# EAGLE design stoomshield1 (EAGLE 7.2.0)
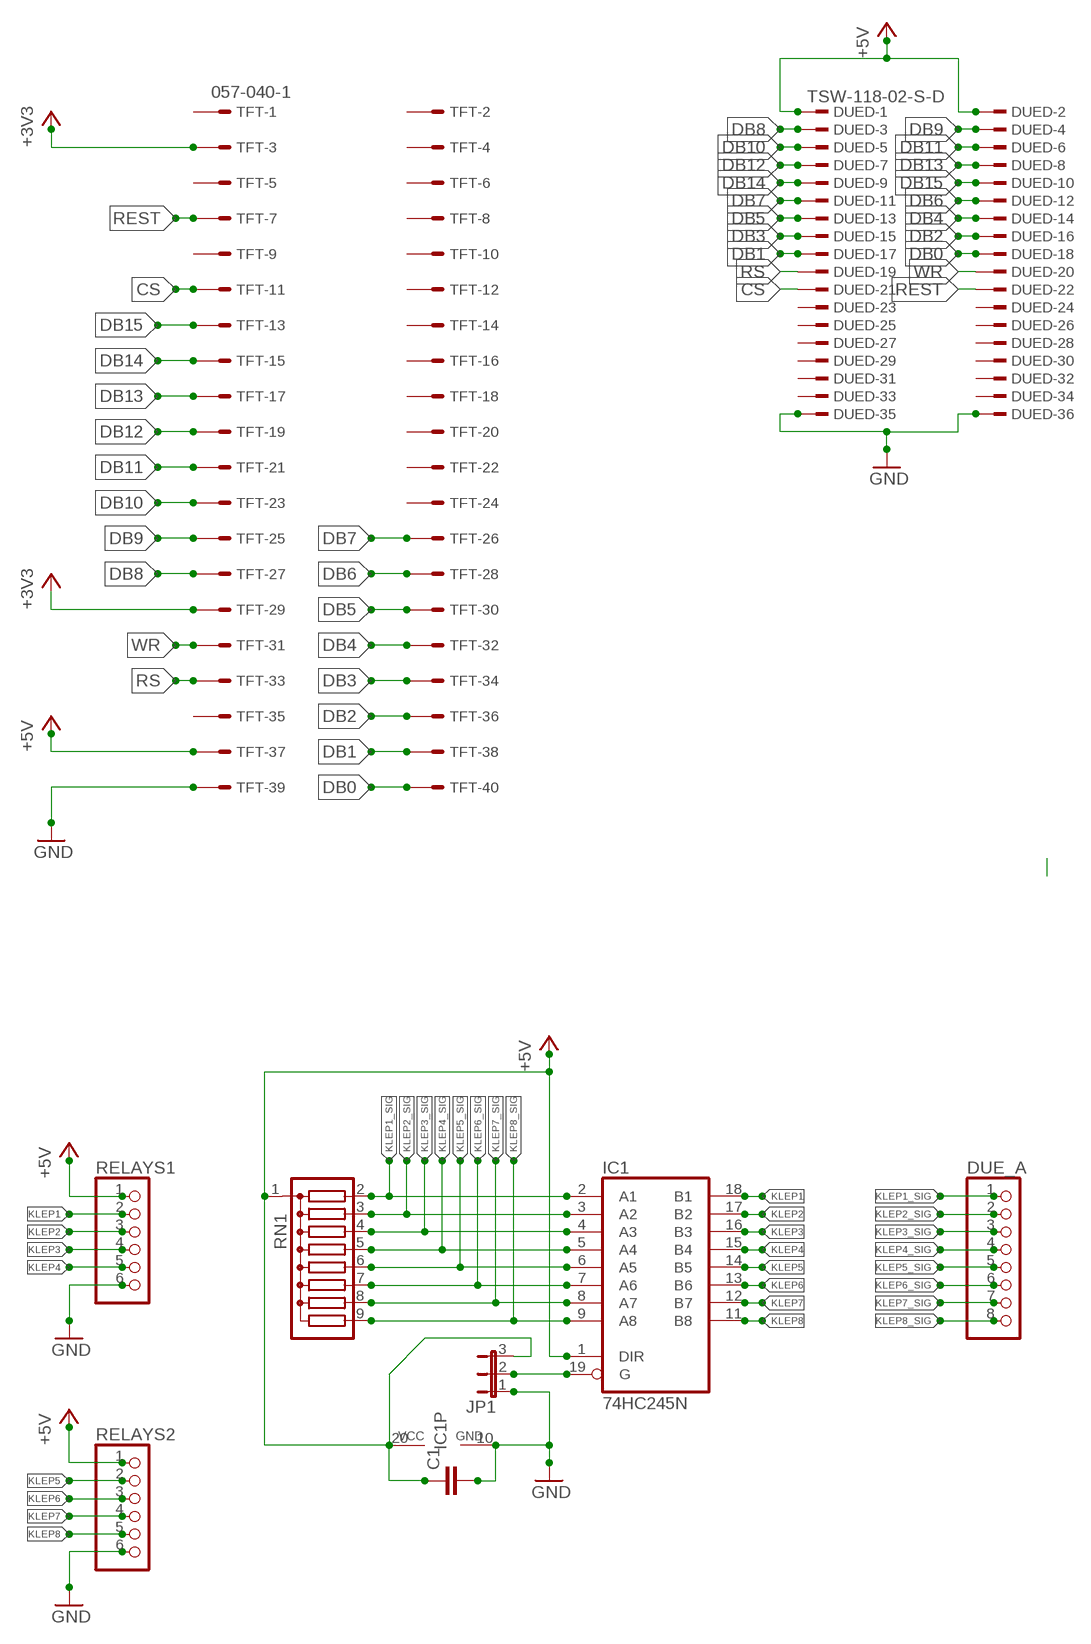
[diagram p0: schematic, sheet 1, part 1 of 2]
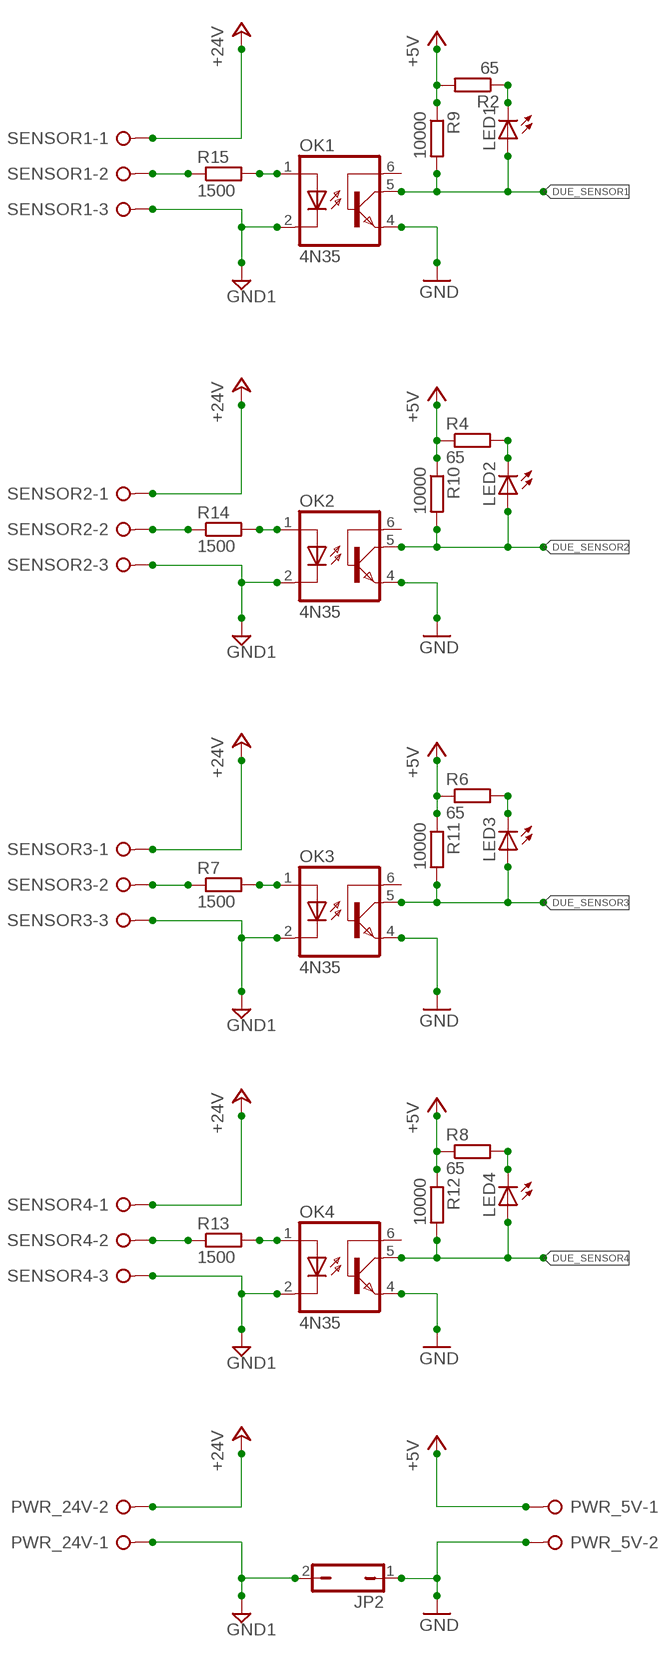
[diagram p1: schematic, sheet 1, part 2 of 2]

## Parts
C1  C-EU025-024X044  [C025-024X044]
DUE_A  PINHD-1X8  [1X08]
DUED  TSW-118-02-S-D  [TSW-118-02-S-D]
IC1  74HC245N  [DIL20]
JP1  JP2E  [JP2]
JP2  JP1Q  [JP1]
LED1  LED5MM  [LED5MM]
LED2  LED5MM  [LED5MM]
LED3  LED5MM  [LED5MM]
LED4  LED5MM  [LED5MM]
OK1  4N35  [DIL06]
OK2  4N35  [DIL06]
OK3  4N35  [DIL06]
OK4  4N35  [DIL06]
PWR_5V  W237-02P  [W237-132]
PWR_24V  W237-02P  [W237-132]
R2  65  R-EU_0204/5  [0204/5]
R4  65  R-EU_0204/5  [0204/5]
R6  65  R-EU_0204/5  [0204/5]
R7  1500  R-EU_0204/5  [0204/5]
R8  65  R-EU_0204/5  [0204/5]
R9  10000  R-EU_0204/5  [0204/5]
R10  10000  R-EU_0204/5  [0204/5]
R11  10000  R-EU_0204/5  [0204/5]
R12  10000  R-EU_0204/5  [0204/5]
R13  1500  R-EU_0204/5  [0204/5]
R14  1500  R-EU_0204/5  [0204/5]
R15  1500  R-EU_0204/5  [0204/5]
RELAYS1  PINHD-1X6  [1X06]
RELAYS2  PINHD-1X6  [1X06]
RN1  G08R  [SIL9]
SENSOR1  W237-03P  [W237-133]
SENSOR2  W237-03P  [W237-133]
SENSOR3  W237-03P  [W237-133]
SENSOR4  W237-03P  [W237-133]
TFT  057-040-1  [057-040-1]

## Nets
+3V3: TFT.3 TFT.29
+5V: C1.1 DUED.1 DUED.2 IC1.1(DIR) IC1.20(VCC) JP1.3 PWR_5V.1 R2.2 R4.1 R6.1 R8.1 R9.1 R10.1 R11.1 R12.1 RELAYS1.1 RELAYS2.1 RN1.1 TFT.37
+24V: PWR_24V.2 SENSOR1.1 SENSOR2.1 SENSOR3.1 SENSOR4.1
CS: DUED.21 TFT.11
DB0: DUED.18 TFT.40
DB1: DUED.17 TFT.38
DB2: DUED.16 TFT.36
DB3: DUED.15 TFT.34
DB4: DUED.14 TFT.32
DB5: DUED.13 TFT.30
DB6: DUED.12 TFT.28
DB7: DUED.11 TFT.26
DB8: DUED.3 TFT.27
DB9: DUED.4 TFT.25
DB10: DUED.5 TFT.23
DB11: DUED.6 TFT.21
DB12: DUED.7 TFT.19
DB13: DUED.8 TFT.17
DB14: DUED.9 TFT.15
DB15: DUED.10 TFT.13
DUE_SENSOR1: LED1.A OK1.5(COL) R9.2
DUE_SENSOR2: LED2.A OK2.5(COL) R10.2
DUE_SENSOR3: LED3.A OK3.5(COL) R11.2
DUE_SENSOR4: LED4.A OK4.5(COL) R12.2
GND: C1.2 DUED.35 DUED.36 IC1.10(GND) JP1.1 JP2.1 OK1.4(EMI) OK2.4(EMI) OK3.4(EMI) OK4.4(EMI) PWR_5V.2 RELAYS1.6 RELAYS2.6 TFT.39
GND1: JP2.2 OK1.2(C) OK2.2(C) OK3.2(C) OK4.2(C) PWR_24V.1 SENSOR1.3 SENSOR2.3 SENSOR3.3 SENSOR4.3
KLEP1: IC1.18(B1) RELAYS1.2
KLEP1_SIG: DUE_A.1 IC1.2(A1) RN1.2
KLEP2: IC1.17(B2) RELAYS1.3
KLEP2_SIG: DUE_A.2 IC1.3(A2) RN1.3
KLEP3: IC1.16(B3) RELAYS1.4
KLEP3_SIG: DUE_A.3 IC1.4(A3) RN1.4
KLEP4: IC1.15(B4) RELAYS1.5
KLEP4_SIG: DUE_A.4 IC1.5(A4) RN1.5
KLEP5: IC1.14(B5) RELAYS2.2
KLEP5_SIG: DUE_A.5 IC1.6(A5) RN1.6
KLEP6: IC1.13(B6) RELAYS2.3
KLEP6_SIG: DUE_A.6 IC1.7(A6) RN1.7
KLEP7: IC1.12(B7) RELAYS2.4
KLEP7_SIG: DUE_A.7 IC1.8(A7) RN1.8
KLEP8: IC1.11(B8) RELAYS2.5
KLEP8_SIG: DUE_A.8 IC1.9(A8) RN1.9
N$1: IC1.19(G) JP1.2
N$3: R15.1 SENSOR1.2
N$4: OK1.1(A) R15.2
N$5: LED1.K(C) R2.1
N$6: OK2.1(A) R14.2
N$7: R14.1 SENSOR2.2
N$8: LED2.K(C) R4.2
N$9: OK3.1(A) R7.2
N$10: R7.1 SENSOR3.2
N$11: LED3.K(C) R6.2
N$12: OK4.1(A) R13.2
N$13: R13.1 SENSOR4.2
N$14: LED4.K(C) R8.2
REST: DUED.22 TFT.7
RS: DUED.19 TFT.33
WR: DUED.20 TFT.31
Unconnected: DUED.23 DUED.24 DUED.25 DUED.26 DUED.27 DUED.28 DUED.29 DUED.30 DUED.31 DUED.32 DUED.33 DUED.34 OK1.6(BAS) OK2.6(BAS) OK3.6(BAS) OK4.6(BAS) TFT.1 TFT.2 TFT.4 TFT.5 TFT.6 TFT.8 TFT.9 TFT.10 TFT.12 TFT.14 TFT.16 TFT.18 TFT.20 TFT.22 TFT.24 TFT.35

## Library data of the parts
C1 = rcl:C-EU: CAPACITOR, European symbol
DUE_A = pinhead:PINHD-1X8: PIN HEADER
DUED = con-samtec:TSW-118-02-S-D: THROUGH-HOLE .025" SQ POST HEADER Source: Samtec TSW.pdf; OC_FARNELL: unknown; OC_NEWARK: unknown
IC1 = 74xx-eu:74*245: Octal BUS TRANSCEIVER, 3-state
JP1 = jumper:JP2E: JUMPER
JP2 = jumper:JP1Q: JUMPER
LED1-LED4 = led:LED: LED OSRAM: - CHIPLED LG R971, LG N971, LY N971, LG Q971, LY Q971, LO R971, LY R971 LH N974, LH R974 LS Q976, LO Q976, LY Q976 LO Q996 - Hyper CHIPLED LW Q18S LB Q993, LB Q99A, LB R99A - SideLED LS A670, LO A670, LY A670, LG A670, LP A670 LB A673, LV A673, LT A673, LW A673 LH A674 LY A675 LS A676, LA A676, LO A676, LY A676, LW A676 LS A679, LY A679, LG A679 - Hyper Micro SIDELED® LS Y876, LA Y876, LO Y876, LY Y876 LT Y87S - SmartLED LW L88C, LW L88S LB L89C, LB L89S, LG L890 LS L89K, LO L89K, LY L89K LS L896, LA L896, LO L896, LY L896 - TOPLED LS T670, LO T670, LY T670, LG T670, LP T670 LSG T670, LSP T670, LSY T670, LOP T670, LYG T670 LG T671, LOG T671, LSG T671 LB T673, LV T673, LT T673, LW T673 LH T674 LS T676, LA T676, LO T676, LY T676, LB T676, LH T676, LSB T676, LW T676 LB T67C, LV T67C, LT T67C, LS T67K, LO T67K, LY T67K, LW E67C LS E67B, LA E67B, LO E67B, LY E67B, LB E67C, LV E67C, LT E67C LW T67C LS T679, LY T679, LG T679 LS T770, LO T770, LY T770, LG T770, LP T770 LB T773, LV T773, LT T773, LW T773 LH T774 LS E675, LA E675, LY E675, LS T675 LS T776, LA T776, LO T776, LY T776, LB T776 LHGB T686 LT T68C, LB T68C - Hyper Mini TOPLED® LB M676 - Mini TOPLED Santana® LG M470 LS M47K, LO M47K, LY M47K Source: http://www.osram.convergy.de LUXEON: - LUMILED® LXK2-PW12-R00, LXK2-PW12-S00, LXK2-PW14-U00, LXK2-PW14-V00 LXK2-PM12-R00, LXK2-PM12-S00, LXK2-PM14-U00 LXK2-PE12-Q00, LXK2-PE12-R00, LXK2-PE12-S00, LXK2-PE14-T00, LXK2-PE14-U00 LXK2-PB12-K00, LXK2-PB12-L00, LXK2-PB12-M00, LXK2-PB14-N00, LXK2-PB14-P00, LXK2-PB14-Q00 LXK2-PR12-L00, LXK2-PR12-M00, LXK2-PR14-Q00, LXK2-PR14-R00 LXK2-PD12-Q00, LXK2-PD12-R00, LXK2-PD12-S00 LXK2-PH12-R00, LXK2-PH12-S00 LXK2-PL12-P00, LXK2-PL12-Q00, LXK2-PL12-R00 Source: www.luxeon.com KINGBRIGHT: KA-3528ASYC Source: www.kingbright.com
OK1-OK4 = optocoupler:4N35: MOTOROLA OPTO COUPLER; MF: FAIRCHILD SEMICONDUCTOR; MPN: 4N35; OC_FARNELL: 1328375; OC_NEWARK: 72K9946
PWR_5V PWR_24V = con-wago-508:W237-02P: WAGO SREW CLAMP; OC_FARNELL: unknown; OC_NEWARK: unknown
R2 R4 R6-R15 = resistor:R-EU_: RESISTOR, European symbol
RELAYS1 RELAYS2 = pinhead:PINHD-1X6: PIN HEADER
RN1 = resistor-sil:G08R: SIL RESISTOR; OC_FARNELL: unknown; OC_NEWARK: unknown
SENSOR1-SENSOR4 = con-wago-508:W237-03P: WAGO SREW CLAMP; OC_FARNELL: unknown; OC_NEWARK: unknown
TFT = con-panduit:057-040-: CONNECTOR 40-pin series 057 contact pc board low profile headers; OC_FARNELL: unknown; OC_NEWARK: unknown

## Board
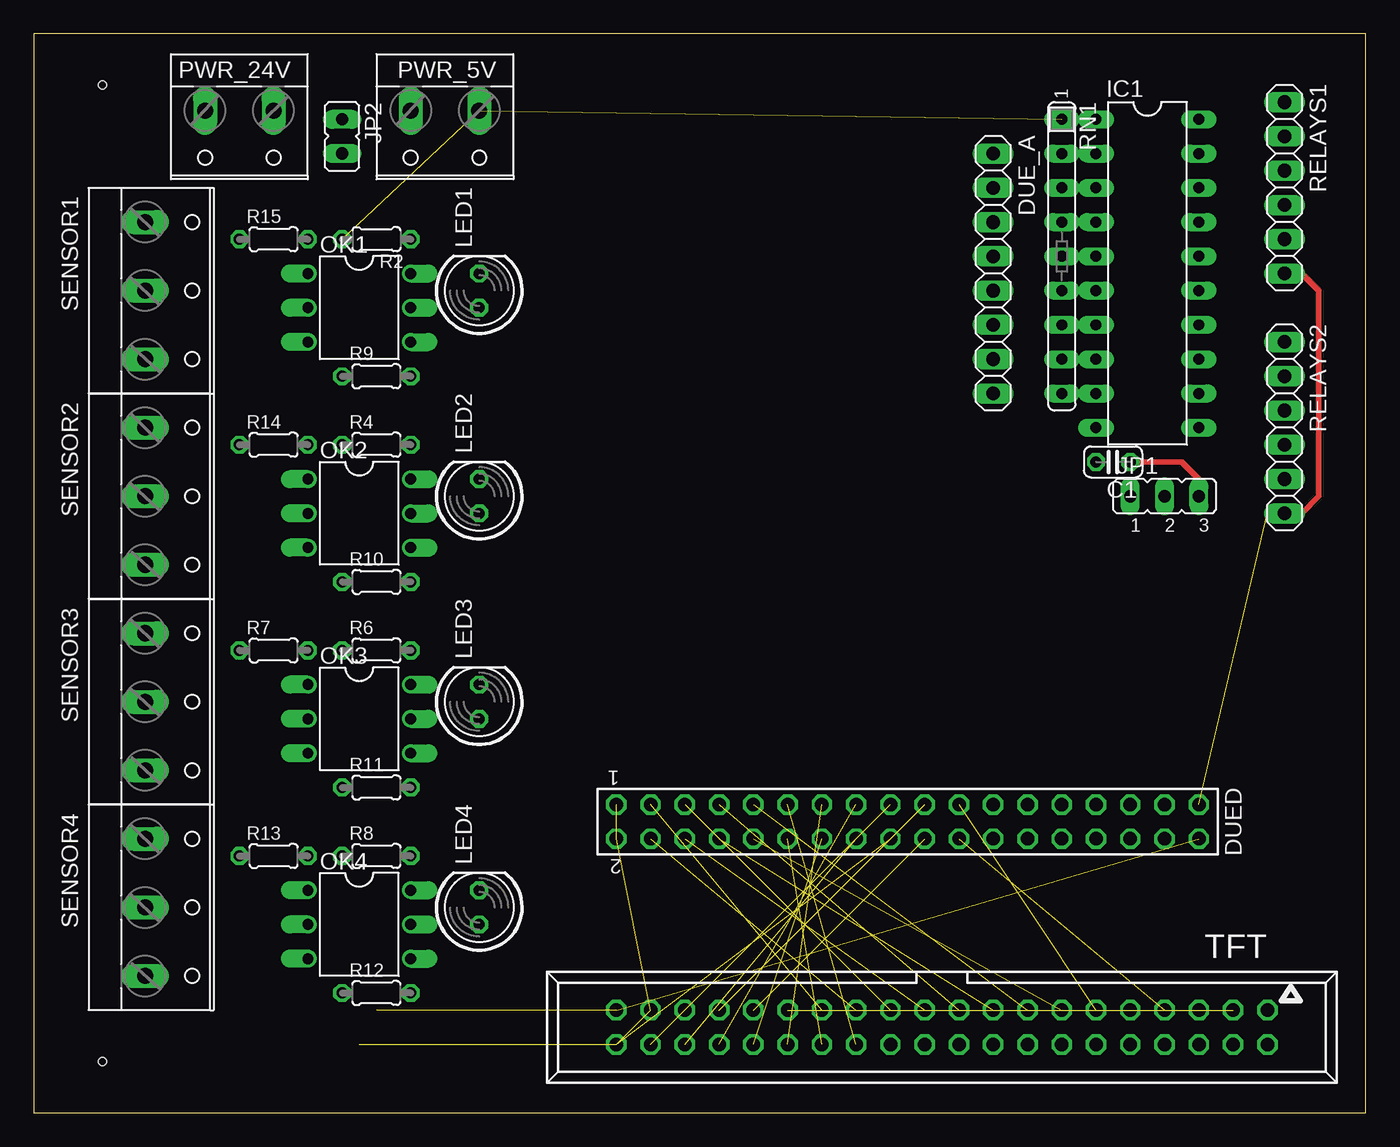
[diagram p2: board, top side]
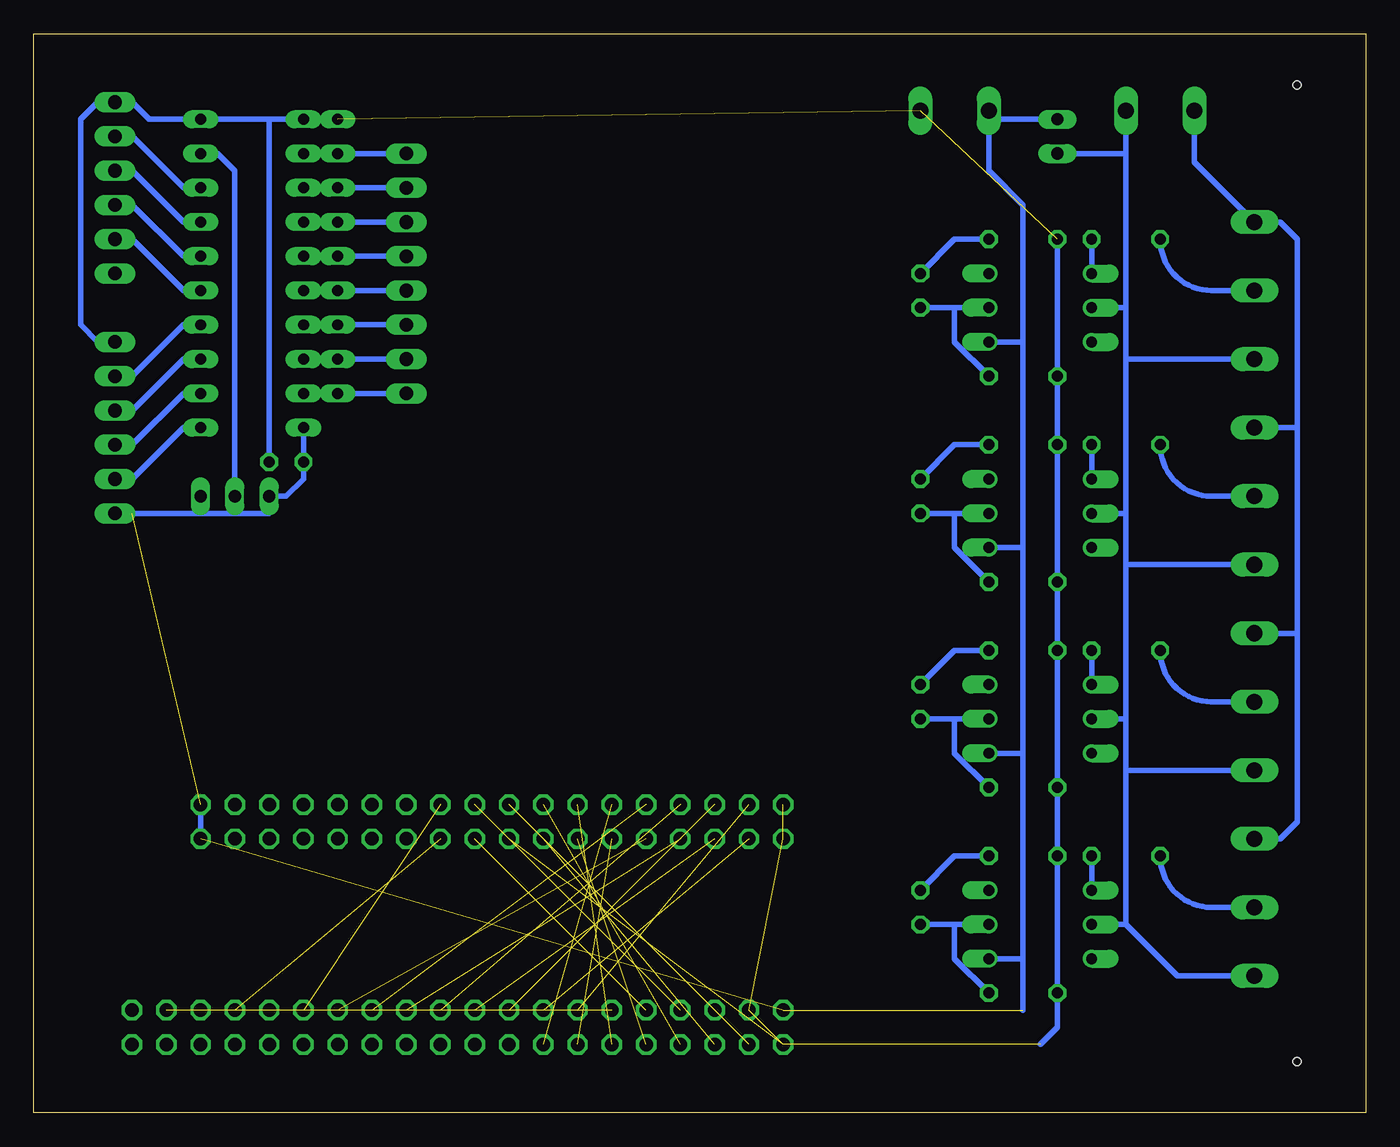
[diagram p3: board, bottom side, seen from below]

Size 98.73 x 80 mm. Coordinates in mm from the lower left corner, seen from the top.
Outline: 0,0 98.73,0 98.73,80 0,80 0,0
Copper layers (1*16): Top 0.035mm / dielectric 1.5mm / Bottom 0.035mm
Design rules "default": minimum track width 10mil, minimum drill 24mil, track to track 8mil, track to pad 8mil, pad to pad 8mil, via to via 8mil, smd to smd 8mil, copper to edge 40mil, drill to drill 8mil, minimum pad ring 10mil, minimum via ring 8mil, stop-mask expansion 4mil, vias tented up to drill 0mil, thermal gap 10mil
Holes 0.6 mm at 5.08,76.2 5.08,3.81

### Footprints (pad centres in the part's own frame; a part is rotated, then mirrored left to right if it is on the bottom)
C025-024X044 = drill 0.813 octagon: 1 -1.27,0; 2 1.27,0
1X08 = drill 1.016 long: 1 -8.89,0; 2 -6.35,0; 3 -3.81,0; 4 -1.27,0; 5 1.27,0; 6 3.81,0; 7 6.35,0; 8 8.89,0
TSW-118-02-S-D = drill 1 pad 1.5 octagon: 1 21.59,-1.27; 2 21.59,1.27; 3 19.05,-1.27; 4 19.05,1.27; 5 16.51,-1.27; 6 16.51,1.27; 7 13.97,-1.27; 8 13.97,1.27; 9 11.43,-1.27; 10 11.43,1.27; 11 8.89,-1.27; 12 8.89,1.27; 13 6.35,-1.27; 14 6.35,1.27; 15 3.81,-1.27; 16 3.81,1.27; 17 1.27,-1.27; 18 1.27,1.27; 19 -1.27,-1.27; 20 -1.27,1.27; 21 -3.81,-1.27; 22 -3.81,1.27; 23 -6.35,-1.27; 24 -6.35,1.27; 25 -8.89,-1.27; 26 -8.89,1.27; 27 -11.43,-1.27; 28 -11.43,1.27; 29 -13.97,-1.27; 30 -13.97,1.27; 31 -16.51,-1.27; 32 -16.51,1.27; 33 -19.05,-1.27; 34 -19.05,1.27; 35 -21.59,-1.27; 36 -21.59,1.27
DIL20 = drill 0.813 long: 1 -11.43,-3.81; 2 -8.89,-3.81; 3 -6.35,-3.81; 4 -3.81,-3.81; 5 -1.27,-3.81; 6 1.27,-3.81; 7 3.81,-3.81; 8 6.35,-3.81; 9 8.89,-3.81; 10 11.43,-3.81; 11 11.43,3.81; 12 8.89,3.81; 13 6.35,3.81; 14 3.81,3.81; 15 1.27,3.81; 16 -1.27,3.81; 17 -3.81,3.81; 18 -6.35,3.81; 19 -8.89,3.81; 20 -11.43,3.81
JP2 = drill 0.914 long: 1 -2.54,0; 2 0,0; 3 2.54,0
JP1 = drill 0.914 long: 1 0,-1.27; 2 0,1.27
LED5MM = drill 0.813 octagon: A -1.27,0; K 1.27,0
DIL06 = drill 0.813 offset: 1 -2.54,-3.81; 2 0,-3.81; 3 2.54,-3.81; 4 2.54,3.81; 5 0,3.81; 6 -2.54,3.81
W237-132 = drill 1.194 long: 1 -2.54,-0.635; 2 2.54,-0.635
0204/5 = drill 0.813 octagon: 1 -2.54,0; 2 2.54,0
1X06 = drill 1.016 long: 1 -6.35,0; 2 -3.81,0; 3 -1.27,0; 4 1.27,0; 5 3.81,0; 6 6.35,0
SIL9 = drill 0.813 long: 1 -10.16,0; 2 -7.62,0; 3 -5.08,0; 4 -2.54,0; 5 0,0; 6 2.54,0; 7 5.08,0; 8 7.62,0; 9 10.16,0
W237-133 = drill 1.194 long: 1 -5.08,-0.635; 2 0,-0.635; 3 5.08,-0.635
057-040-1 = drill 1 octagon: 1 -24.13,-1.27; 2 -24.13,1.27; 3 -21.59,-1.27; 4 -21.59,1.27; 5 -19.05,-1.27; 6 -19.05,1.27; 7 -16.51,-1.27; 8 -16.51,1.27; 9 -13.97,-1.27; 10 -13.97,1.27; 11 -11.43,-1.27; 12 -11.43,1.27; 13 -8.89,-1.27; 14 -8.89,1.27; 15 -6.35,-1.27; 16 -6.35,1.27; 17 -3.81,-1.27; 18 -3.81,1.27; 19 -1.27,-1.27; 20 -1.27,1.27; 21 1.27,-1.27; 22 1.27,1.27; 23 3.81,-1.27; 24 3.81,1.27; 25 6.35,-1.27; 26 6.35,1.27; 27 8.89,-1.27; 28 8.89,1.27; 29 11.43,-1.27; 30 11.43,1.27; 31 13.97,-1.27; 32 13.97,1.27; 33 16.51,-1.27; 34 16.51,1.27; 35 19.05,-1.27; 36 19.05,1.27; 37 21.59,-1.27; 38 21.59,1.27; 39 24.13,-1.27; 40 24.13,1.27

### Placement (x,y rotation side)
C1  80.01,48.26 180 top
DUE_A  71.12,62.23 270 top
DUED  64.77,21.59 180 top
IC1  82.55,62.23 270 top
JP1  83.82,45.72 0 top
JP2  22.86,72.39 180 top
LED1  33.02,60.96 90 top
LED2  33.02,45.72 90 top
LED3  33.02,30.48 90 top
LED4  33.02,15.24 90 top
OK1  24.13,59.69 270 top
OK2  24.13,44.45 270 top
OK3  24.13,29.21 270 top
OK4  24.13,13.97 270 top
PWR_5V  30.48,73.66 180 top
PWR_24V  15.24,73.66 180 top
R2  25.4,64.77 180 top
R4  25.4,49.53 0 top
R6  25.4,34.29 0 top
R7  17.78,34.29 0 top
R8  25.4,19.05 0 top
R9  25.4,54.61 0 top
R10  25.4,39.37 0 top
R11  25.4,24.13 0 top
R12  25.4,8.89 0 top
R13  17.78,19.05 0 top
R14  17.78,49.53 0 top
R15  17.78,64.77 0 top
RELAYS1  92.71,68.58 270 top
RELAYS2  92.71,50.8 270 top
RN1  76.2,63.5 270 top
SENSOR1  8.89,60.96 270 top
SENSOR2  8.89,45.72 270 top
SENSOR3  8.89,30.48 270 top
SENSOR4  8.89,15.24 270 top
TFT  67.31,6.35 180 top

### Tracks (layer width: path | path; a pad name or v marks a point on that pad's centre or on a via)
+3V3  (1 unrouted)
+5V  (6 unrouted)
  Top 0.406: C1.1 85.09,48.26 86.36,46.99 JP1.3
  Bottom 0.406: R2.2 R9.1 R4.1 R10.1 R6.1 R11.1 R8.1 R12.1 22.86,6.35 24.13,5.08 | 81.28,73.66 IC1.1 RN1.1 | 81.28,73.66 IC1.20 90.17,73.66 91.44,74.93 RELAYS1.1 93.98,74.93 95.25,73.66 95.25,58.42 93.98,57.15 RELAYS2.1 | C1.1 81.28,73.66
+24V
  Bottom 0.406: PWR_24V.2 12.7,70.48 SENSOR1.1 6.35,66.04 5.08,64.77 5.08,50.8 | 5.08,50.8 5.08,35.56 | 5.08,35.56 5.08,21.59 6.35,20.32 SENSOR4.1 | SENSOR2.1 5.08,50.8 | SENSOR3.1 5.08,35.56
CS  (1 unrouted)
DB0  (1 unrouted)
DB1  (1 unrouted)
DB2  (1 unrouted)
DB3  (1 unrouted)
DB4  (1 unrouted)
DB5  (1 unrouted)
DB6  (1 unrouted)
DB7  (1 unrouted)
DB8  (1 unrouted)
DB9  (1 unrouted)
DB10  (1 unrouted)
DB11  (1 unrouted)
DB12  (1 unrouted)
DB13  (1 unrouted)
DB14  (1 unrouted)
DB15  (1 unrouted)
DUE_SENSOR1
  Bottom 0.406: OK1.5 30.48,59.69 | 30.48,59.69 LED1.A | R9.2 30.48,57.15 30.48,59.69
DUE_SENSOR2
  Bottom 0.406: OK2.5 30.48,44.45 | 30.48,44.45 LED2.A | R10.2 30.48,41.91 30.48,44.45
DUE_SENSOR3
  Bottom 0.406: OK3.5 30.48,29.21 | 30.48,29.21 LED3.A | R11.2 30.48,26.67 30.48,29.21
DUE_SENSOR4
  Bottom 0.406: OK4.5 30.48,13.97 | 30.48,13.97 LED4.A | R12.2 30.48,11.43 30.48,13.97
GND  (3 unrouted)
  Top 0.406: RELAYS1.6 93.98,62.23 95.25,60.96 95.25,45.72 93.98,44.45 RELAYS2.6
  Bottom 0.406: 25.4,11.43 25.4,26.67 | 25.4,26.67 25.4,41.91 | 25.4,41.91 25.4,57.15 | OK1.4 25.4,57.15 | OK2.4 25.4,41.91 | OK3.4 25.4,26.67 | JP2.1 27.3,73.66 arc90 PWR_5V.2 27.94,69.85 25.4,67.31 25.4,57.15 | OK4.4 25.4,11.43 | 25.4,11.43 25.4,7.62 | 91.44,44.45 RELAYS2.6 81.28,44.45 JP1.1 80.01,45.72 78.74,46.99 C1.2 IC1.10 | DUED.36 DUED.35
GND1
  Bottom 0.406: JP2.2 17.78,71.12 | 17.78,71.12 PWR_24V.1 | SENSOR4.3 13.97,10.16 17.78,13.97 | 17.78,13.97 OK4.2 | 17.78,13.97 17.78,25.4 | 17.78,25.4 17.78,29.21 | 17.78,29.21 17.78,40.64 | 17.78,40.64 17.78,44.45 | 17.78,44.45 17.78,55.88 | 17.78,55.88 17.78,59.69 | 17.78,59.69 17.78,71.12 | OK1.2 17.78,59.69 | SENSOR1.3 17.78,55.88 | OK2.2 17.78,44.45 | SENSOR2.3 17.78,40.64 | OK3.2 17.78,29.21 | SENSOR3.3 17.78,25.4
KLEP1
  Bottom 0.406: IC1.18 87.63,68.58 91.44,72.39 RELAYS1.2
KLEP1_SIG
  Bottom 0.406: IC1.2 RN1.2 DUE_A.1
KLEP2
  Bottom 0.406: IC1.17 87.63,66.04 91.44,69.85 RELAYS1.3
KLEP2_SIG
  Bottom 0.406: IC1.3 RN1.3 DUE_A.2
KLEP3
  Bottom 0.406: IC1.16 87.63,63.5 91.44,67.31 RELAYS1.4
KLEP3_SIG
  Bottom 0.406: IC1.4 RN1.4 DUE_A.3
KLEP4
  Bottom 0.406: IC1.15 87.63,60.96 91.44,64.77 RELAYS1.5
KLEP4_SIG
  Bottom 0.406: IC1.5 RN1.5 DUE_A.4
KLEP5
  Bottom 0.406: IC1.14 87.63,58.42 91.44,54.61 RELAYS2.2
KLEP5_SIG
  Bottom 0.406: IC1.6 RN1.6 DUE_A.5
KLEP6
  Bottom 0.406: IC1.13 87.63,55.88 91.44,52.07 RELAYS2.3
KLEP6_SIG
  Bottom 0.406: IC1.7 RN1.7 DUE_A.6
KLEP7
  Bottom 0.406: IC1.12 87.63,53.34 91.44,49.53 RELAYS2.4
KLEP7_SIG
  Bottom 0.406: IC1.8 RN1.8 DUE_A.7
KLEP8
  Bottom 0.406: IC1.11 87.63,50.8 91.44,46.99 RELAYS2.5
KLEP8_SIG
  Bottom 0.406: IC1.9 RN1.9 DUE_A.8
N$1
  Bottom 0.406: IC1.19 85.09,71.12 83.82,69.85 JP1.2
N$3
  Bottom 0.406: SENSOR1.2 11.43,60.96 arc90 R15.1
N$4
  Bottom 0.406: R15.2 OK1.1
N$5
  Bottom 0.406: LED1.K 30.48,64.77 R2.1
N$6
  Bottom 0.406: R14.2 OK2.1
N$7
  Bottom 0.406: SENSOR2.2 11.43,45.72 arc90 R14.1
N$8
  Bottom 0.406: R4.2 30.48,49.53 LED2.K
N$9
  Bottom 0.406: R7.2 OK3.1
N$10
  Bottom 0.406: SENSOR3.2 11.43,30.48 arc90 R7.1
N$11
  Bottom 0.406: LED3.K 30.48,34.29 R6.2
N$12
  Bottom 0.406: R13.2 OK4.1
N$13
  Bottom 0.406: SENSOR4.2 11.43,15.24 arc90 R13.1
N$14
  Bottom 0.406: R8.2 30.48,19.05 LED4.K
REST  (1 unrouted)
RS  (1 unrouted)
WR  (1 unrouted)